# EAGLE design LED_MOUNT_J002609C (EAGLE 7.7.0)
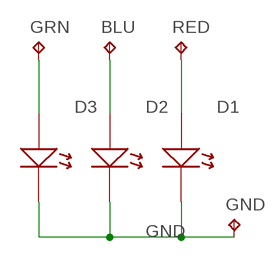
[diagram p0: schematic, sheet 1]

## Parts
BLU  TPTP20SQ  [TP20SQ]
D1  LEDLED_SFH4050  [LED_SFH4050]
D2  LEDLED_SFH4050  [LED_SFH4050]
D3  LEDLED_SFH4050  [LED_SFH4050]
GND  TPTP20SQ  [TP20SQ]
GRN  TPTP20SQ  [TP20SQ]
RED  TPTP20SQ  [TP20SQ]

## Nets
GND: D1.C(K) D2.C(K) D3.C(K) GND.TP
N$1: BLU.TP D2.A
N$5: D1.A RED.TP
N$6: D3.A GRN.TP

## Library data of the parts
BLU GND GRN RED = testpad:TP: Test pad
D1-D3 = STEVES_BU:LED

## Board
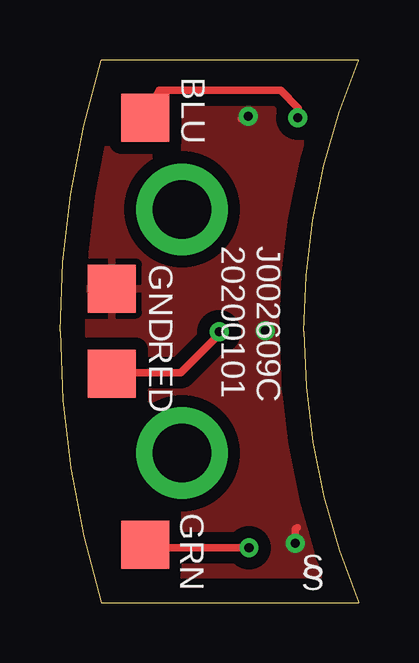
[diagram p1: board, top side]
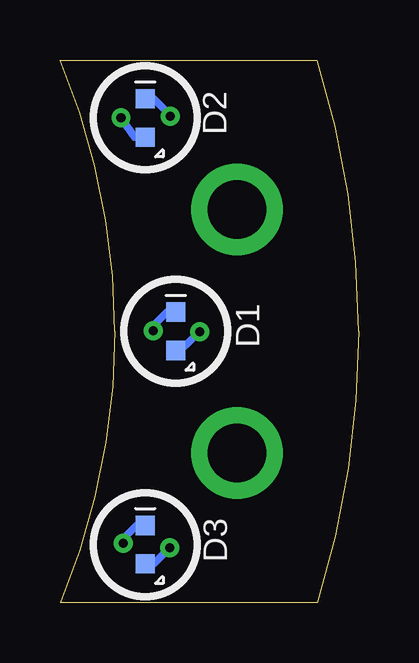
[diagram p2: board, bottom side, seen from below]

Size 12.45 x 22.61 mm. Coordinates in mm from the lower left corner, seen from the top.
Outline: 10.16,11.3 arc-23 12.45,22.61 1.73,22.61 arc17 0,11.3 arc17 1.73,0 12.45,0 arc-23 10.16,11.3
Copper layers (1*16): Top 0.035mm / dielectric 1.5mm / Bottom 0.035mm
Design rules "default *": minimum track width 10mil, minimum drill 12mil, track to track 8mil, track to pad 8mil, pad to pad 8mil, via to via 8mil, smd to smd 8mil, copper to edge 40mil, drill to drill 8mil, minimum pad ring 10mil, minimum via ring 8mil, stop-mask expansion 5mil, vias tented up to drill 17mil, thermal gap 10mil

### Footprints (pad centres in the part's own frame; a part is rotated, then mirrored left to right if it is on the bottom)
TP20SQ = smd 2 x 2: TP 0,0
LED_SFH4050 = smd 0.8 x 0.8: A -0.8,0; C 0.8,0

### Placement (x,y rotation side)
BLU  3.56,20.19 0 top
D1  7.62,11.3 90 bottom
D2  8.89,20.19 90 bottom
D3  8.89,2.41 90 bottom
GND  2.16,13.08 0 top
GRN  3.56,2.41 0 top
RED  2.16,9.53 0 top

### Tracks (layer width: path | path; a pad name or v marks a point on that pad's centre or on a via)
GND  (via drill 0.38)
  Top 0.305: v9.8,2.46 9.8,3.05 9.88,3.12 | v8.56,11.33 8.64,11.33 8.71,11.25 | v7.85,20.27 7.64,20.27 7.54,20.17
  Bottom 0.305: D3.C 9.26,3.21 9.75,2.72 9.75,2.52 v9.8,2.46 | D1.C 7.99,12.1 8.53,11.56 8.53,11.35 v8.56,11.33 | D2.C 8.55,20.99 7.92,20.37 7.92,20.34 v7.85,20.27
  pour Top (isolate 0.508): -1.07,23.98 13.97,24.05 13.97,-1.85 -1.07,-1.93
N$1  (via drill 0.38)
  Top 0.305: v9.91,20.19 9.93,20.6 9.19,21.34 4.14,21.34 BLU.TP
  Bottom 0.305: D2.A 9.33,19.39 v9.91,20.19
N$3  (via drill 2.44 pad 3.81)
  other vias: 5.08,16.38
N$4  (via drill 2.44 pad 3.81)
  other vias: 5.08,6.22
N$5  (via drill 0.38)
  Top 0.305: v6.63,11.28 6.63,11.18 5.03,9.58 2.08,9.58 RED.TP
  Bottom 0.305: D1.A 7.43,10.5 v6.63,11.28
N$6  (via drill 0.38)
  Top 0.305: v7.87,2.29 2.92,2.29 GRN.TP
  Bottom 0.305: D3.A 8.55,1.61 v7.87,2.29

### Text on the board
tPlace: 20200101 | J002609C | S | S